# Altium schematic sheet IndicationBoard.SchDoc
size A4
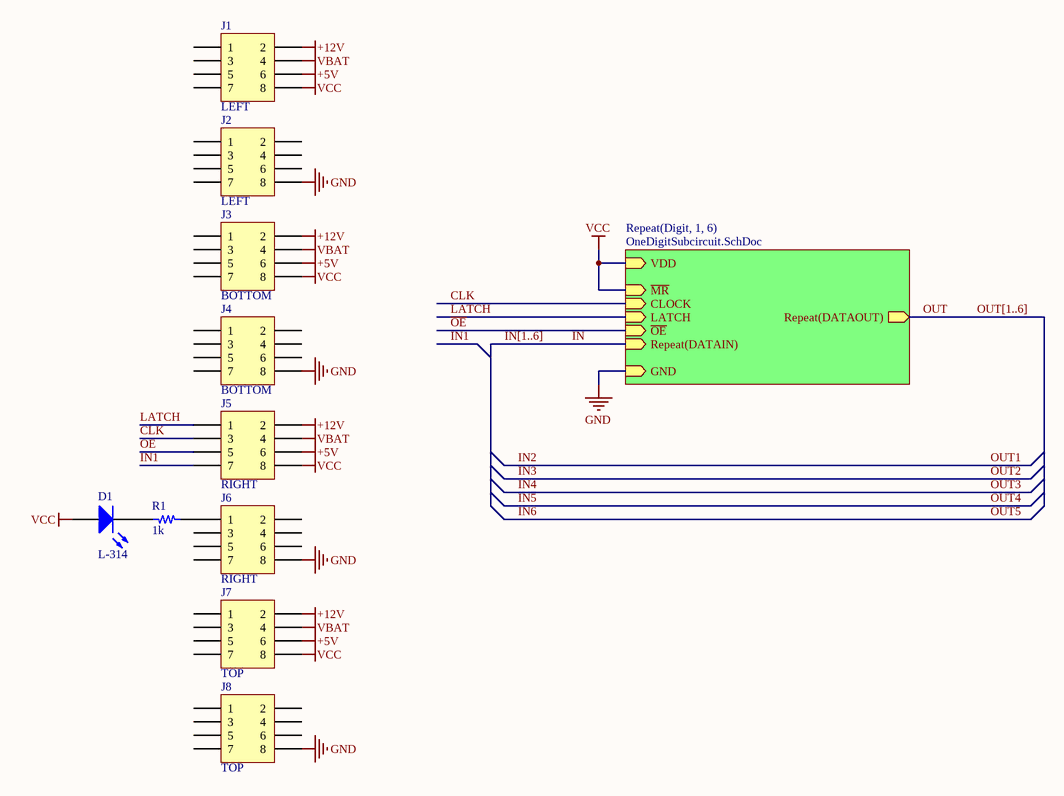
[diagram p0: IndicationBoard.SchDoc]

## Parts
D1  L-314  [LED 3mm]
J1  LEFT  [PBDM-8]
J2  LEFT  [PBDM-8]
J3  BOTTOM  [PBDM-8]
J4  BOTTOM  [PBDM-8]
J5  RIGHT  [PBDM-8]
J6  RIGHT  [PBDM-8]
J7  TOP  [PBDM-8]
J8  TOP  [PBDM-8]
R1  1k  [RES0402]

## Sub-sheets
Repeat(Digit, 1, 6) = OneDigitSubcircuit.SchDoc: VDD (in), GND (in), ~{MR} (in), ~{OE} (in), CLOCK (in), LATCH (in), Repeat(DATAIN) (in), Repeat(DATAOUT) (out)

## Nets
+5V: J1.6 J3.6 J5.6 J7.6
+12V: J1.2 J3.2 J5.2 J7.2
GND: J2.8 J4.8 J6.8 J8.8 ; sheet Repeat(Digit, 1, 6)/GND
VBAT: J1.4 J3.4 J5.4 J7.4
VCC: D1.2 J1.8 J3.8 J5.8 J7.8 ; sheet Repeat(Digit, 1, 6)/VDD, sheet Repeat(Digit, 1, 6)/~{MR}
CLK: J5.3 ; sheet Repeat(Digit, 1, 6)/CLOCK
IN: sheet Repeat(Digit, 1, 6)/Repeat(DATAIN)
IN1: J5.7
LATCH: J5.1 ; sheet Repeat(Digit, 1, 6)/LATCH
~{OE}: J5.5 ; sheet Repeat(Digit, 1, 6)/~{OE}
OUT: sheet Repeat(Digit, 1, 6)/Repeat(DATAOUT)
NetD1_1: D1.1 R1.1
NetJ6_1: J6.1 R1.2

Not connected (* = marked no-connect by the designer): J1 1 3 5 7; J2 1 2 3 4 5 6 7; J3 1 3 5 7; J4 1 2 3 4 5 6 7; J6 2 3 4 5 6 7; J7 1 3 5 7; J8 1 2 3 4 5 6 7

## Buses and harness runs
bus IN[1..6]
bus OUT[1..6]

## Library data of the parts
D1 = L-314: 3-mm LED; PartNumber: L-314; Category: Optical; ComponentLink1Description: Datasheet; ComponentLink1URL: d:\_AltiumLibs\Pdf\Optical\L-3xx (Paralight).pdf#page=2; Author: oiezhov
J1-J8 = PBDM-8: 2x4-pin header, pitch 2.54 mm; PartNumber: PBDM-8; Category: Connector; ComponentLink1Description: Datasheet; ComponentLink1URL: d:\_AltiumLibs\Pdf\Mechanical\Connector\pbsm.pdf; Author: oiezhov
R1 = RES0402: Ceramic chip resistor; PartNumber: RES0402; Value: 1k; Category: Resistor; Author: oiezhov